# EAGLE design power_breakout (EAGLE 6.5.0)
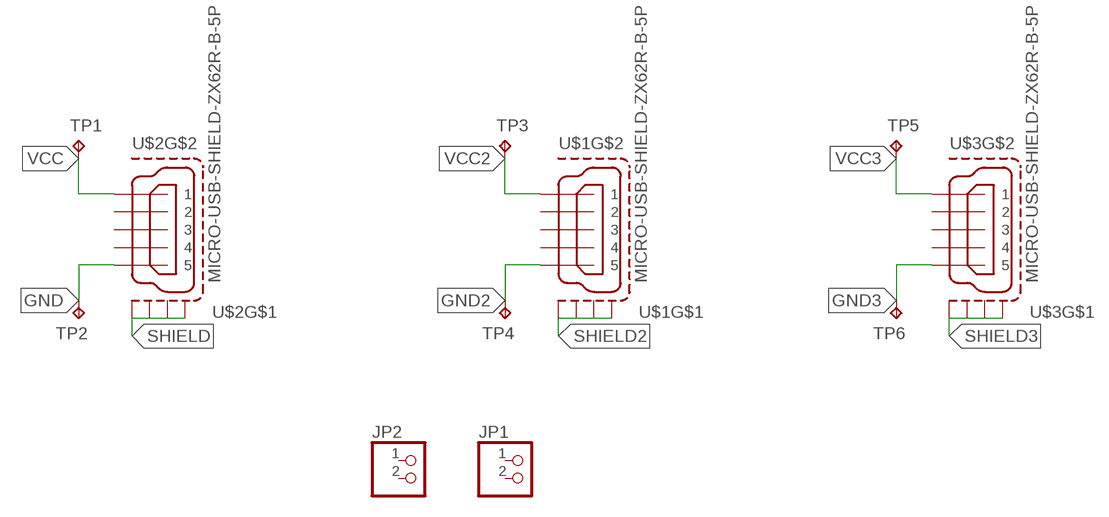
[diagram p0: schematic, sheet 1]

## Parts
JP1  PINHD-1X2/90  [1X02/90]
JP2  PINHD-1X2/90  [1X02/90]
TP1  TPB1,27  [B1,27]
TP2  TPB1,27  [B1,27]
TP3  TPB1,27  [B1,27]
TP4  TPB1,27  [B1,27]
TP5  TPB1,27  [B1,27]
TP6  TPB1,27  [B1,27]
U$1  MICRO-USB-SHIELD-ZX62R-B-5P  [ZX62R-B-5P]
U$2  MICRO-USB-SHIELD-ZX62R-B-5P  [ZX62R-B-5P]
U$3  MICRO-USB-SHIELD-ZX62R-B-5P  [ZX62R-B-5P]

## Nets
GND: TP2.TP U$2.5
GND2: TP4.TP U$1.5
GND3: TP6.TP U$3.5
SHIELD: U$2.M1(S1) U$2.M2(S2) U$2.M3(S3) U$2.M4(S4)
SHIELD2: U$1.M1(S1) U$1.M2(S2) U$1.M3(S3) U$1.M4(S4)
SHIELD3: U$3.M1(S1) U$3.M2(S2) U$3.M3(S3) U$3.M4(S4)
VCC: TP1.TP U$2.1
VCC2: TP3.TP U$1.1
VCC3: TP5.TP U$3.1
Unconnected: JP1.1 JP1.2 JP2.1 JP2.2 U$1.2 U$1.3 U$1.4 U$2.2 U$2.3 U$2.4 U$3.2 U$3.3 U$3.4

## Library data of the parts
JP1 JP2 = pinhead:PINHD-1X2: PIN HEADER
TP1-TP6 = testpad:TP: Test pad
U$1-U$3 = con-hirose2:MICRO-USB-SHIELD-: Hirose Micro USB Connector ZX62R-B-5P: Micro B, reverse (top mount) shell SMT Supplier: DigiKey H11574CT-ND Source: http://www.hirose.co.jp/cataloge_hp/e24200011.pdf

## Board
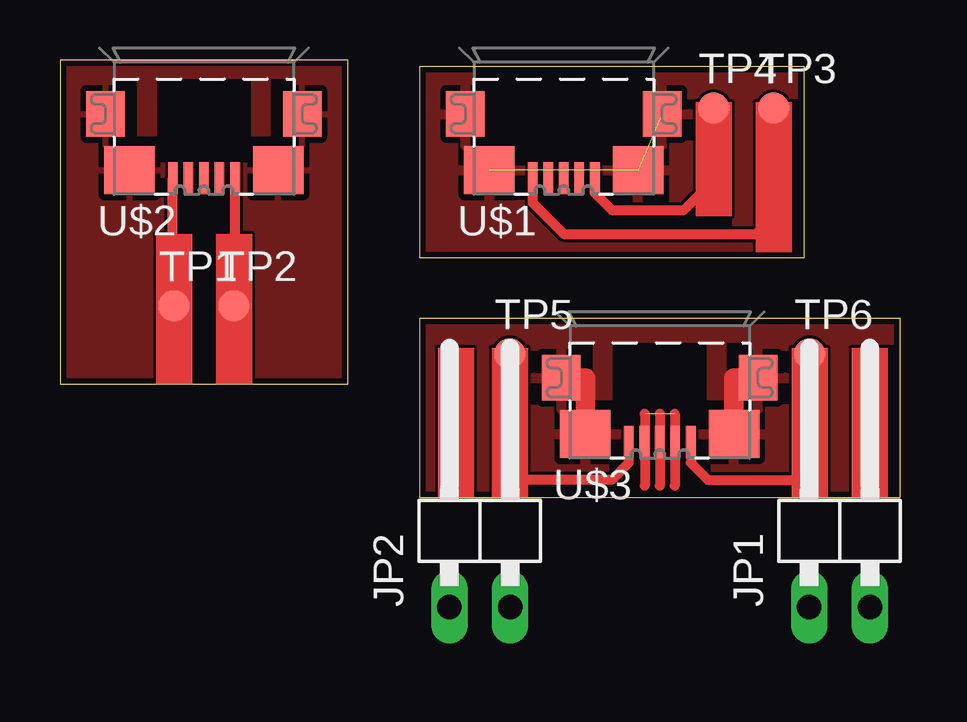
[diagram p1: board, top side]

Size 35 x 18.25 mm. Coordinates in mm from the lower left corner, seen from the top.
Outline: 0,4.75 12,4.75 12,18.25 0,18.25 0,4.75
Outline: 15,10 15,18 31,18 31,10 15,10
Outline: 15,7.5 35,7.5 35,0 15,0 15,7.5
Copper layers (1*16): Top 0.035mm / dielectric 1.5mm / Bottom 0.035mm
Design rules "default *": minimum track width 10mil, minimum drill 24mil, track to track 5mil, track to pad 5mil, pad to pad 5mil, via to via 5mil, smd to smd 5mil, copper to edge 10mil, drill to drill 8mil, minimum pad ring 10mil, minimum via ring 8mil, stop-mask expansion 4mil, vias tented up to drill 0mil, thermal gap 10mil

### Footprints (pad centres in the part's own frame; a part is rotated, then mirrored left to right if it is on the bottom)
1X02/90 = drill 1.016 long: 1 -1.27,-3.81; 2 1.27,-3.81
B1,27 = smd 1.27 x 1.27: TP 0,0
ZX62R-B-5P = smd 1.35 x 0.4: 1 2.675,-1.3; 2 2.675,-0.65; 3 2.675,0; 4 2.675,0.65; 5 2.675,1.3 | smd 1.9 x 1.6: M1 0,-4.1; M2 0,4.1 | smd 2 x 2.1: M3 2.35,3.1; M4 2.35,-3.1

### Placement (x,y rotation side)
JP1  32.5,-0.75 0 top  (outside the outline)
JP2  17.5,-0.75 0 top  (outside the outline)
TP1  4.75,8 0 top
TP2  7.25,8 0 top
TP3  29.75,16.25 0 top
TP4  27.25,16.25 0 top
TP5  18.75,6 0 top
TP6  31.25,6 0 top
U$1  21,16 270 top
U$2  6,16 270 top
U$3  25,5 270 top

### Tracks (layer width: path | path; a pad name or v marks a point on that pad's centre or on a via)
GND
  Top 0.406: TP2.TP 7.3,8 U$2.5
GND2
  Top 0.406: TP4.TP 27.25,13.25 26,12 23,12 22.3,12.7 U$1.5
GND3
  Top 0.406: U$3.5 26.3,1.45 27,0.75 30.75,0.75 31.25,1.25 TP6.TP
N$1  (2 unrouted)
  Top 0.406: 24.38,3.5 24.38,0.5 | 25,3.5 25,0.5 | 25.62,3.5 25.62,0.5
SHIELD
  pour Top: -1,20 13,20 13,4 -1,4
SHIELD2  (2 unrouted)
  pour Top: 14.75,18 32,18 32,9.75 14.75,9.75
SHIELD3
  Top 0.813: U$3.M4 21.9,5 U$3.M1 | U$3.M3 28.1,5 U$3.M2
  pour Top: 14.38,7.88 34.88,7.88 34.88,-0.5 14.38,-0.5
VCC
  Top 0.406: TP1.TP 4.7,8 U$2.1
VCC2
  Top 0.406: U$1.1 19.7,12.3 21,11 29,11 29.75,11.75 TP3.TP
VCC3
  Top 0.406: U$3.1 23.7,1.45 23,0.75 19.25,0.75 18.75,1.25 TP5.TP
(copper drawn outside any net)
  shapes: Top area x8